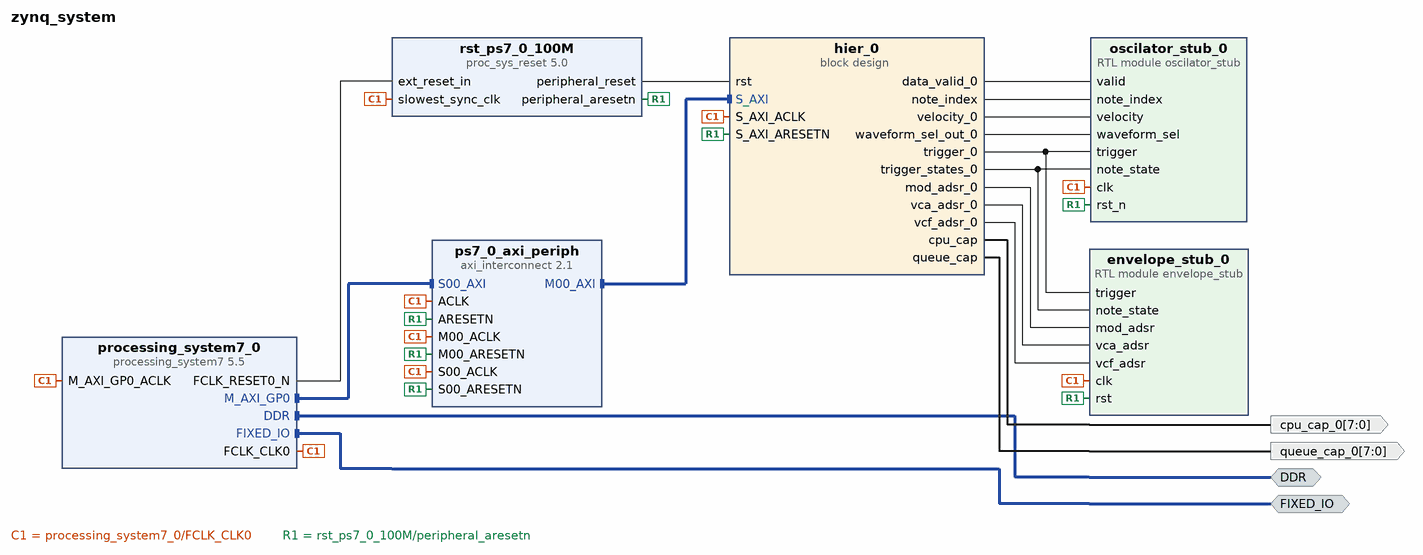
[diagram p0: block diagram of the top level]
# Vivado block design zynq_system, xc7z020clg400-1, Vivado 2021.1
create_bd_design zynq_system

create_bd_intf_port -mode Master -vlnv xilinx.com:interface:ddrx_rtl:1.0 DDR
create_bd_intf_port -mode Master -vlnv xilinx.com:display_processing_system7:fixedio_rtl:1.0 FIXED_IO
create_bd_port -dir O -from 7 -to 0 cpu_cap_0
create_bd_port -dir O -from 7 -to 0 queue_cap_0

create_bd_cell -type ip -vlnv xilinx.com:ip:processing_system7:5.5 processing_system7_0
set_property -dict [list \
  CONFIG.PCW_FPGA0_PERIPHERAL_FREQMHZ 100 \
  CONFIG.PCW_M_AXI_GP0_ENABLE_STATIC_REMAP 1 \
  CONFIG.PCW_M_AXI_GP0_THREAD_ID_WIDTH 6 \
  CONFIG.PCW_UART1_PERIPHERAL_ENABLE 1 \
  CONFIG.PCW_UART1_UART1_IO {MIO 8 .. 9} \
  CONFIG.PCW_UART_PERIPHERAL_FREQMHZ 100 \
  CONFIG.PCW_UIPARAM_GENERATE_SUMMARY NONE \
] [get_bd_cells processing_system7_0]
# 55 more settings of processing_system7_0 are not shown: defaults, MIO pin electricals, DDR timing, and values the tool derives
create_bd_cell -type ip -vlnv xilinx.com:ip:axi_interconnect:2.1 ps7_0_axi_periph
set_property -dict [list \
  CONFIG.ENABLE_ADVANCED_OPTIONS 0 \
  CONFIG.M00_SECURE 1 \
  CONFIG.NUM_MI 1 \
  CONFIG.S00_HAS_DATA_FIFO 0 \
  CONFIG.S00_HAS_REGSLICE 3 \
] [get_bd_cells ps7_0_axi_periph]
create_bd_cell -type ip -vlnv xilinx.com:ip:proc_sys_reset:5.0 rst_ps7_0_100M
create_bd_cell -type container -reference group_0 hier_0
set_property -dict [list \
  CONFIG.ACTIVE_SIM_BD group_0.bd \
  CONFIG.ACTIVE_SYNTH_BD group_0.bd \
  CONFIG.ENABLE_DFX 0 \
  CONFIG.LIST_SIM_BD group_0.bd \
  CONFIG.LIST_SYNTH_BD group_0.bd \
  CONFIG.LOCK_PROPAGATE 0 \
] [get_bd_cells hier_0]
create_bd_cell -type module -reference oscilator_stub oscilator_stub_0
create_bd_cell -type module -reference envelope_stub envelope_stub_0

# ---- connections ----

connect_bd_intf_net [get_bd_intf_ports DDR] [get_bd_intf_pins processing_system7_0/DDR]
connect_bd_intf_net [get_bd_intf_ports FIXED_IO] [get_bd_intf_pins processing_system7_0/FIXED_IO]
connect_bd_intf_net [get_bd_intf_pins processing_system7_0/M_AXI_GP0] [get_bd_intf_pins ps7_0_axi_periph/S00_AXI]
connect_bd_intf_net [get_bd_intf_pins ps7_0_axi_periph/M00_AXI] [get_bd_intf_pins hier_0/S_AXI]
connect_bd_net -net fifo_reader_0_trigger [get_bd_pins hier_0/trigger_0] [get_bd_pins oscilator_stub_0/trigger] [get_bd_pins envelope_stub_0/trigger]
connect_bd_net [get_bd_pins hier_0/cpu_cap] [get_bd_ports cpu_cap_0]
connect_bd_net [get_bd_pins hier_0/data_valid_0] [get_bd_pins oscilator_stub_0/valid]
connect_bd_net [get_bd_pins hier_0/mod_adsr_0] [get_bd_pins envelope_stub_0/mod_adsr]
connect_bd_net [get_bd_pins hier_0/note_index] [get_bd_pins oscilator_stub_0/note_index]
connect_bd_net [get_bd_pins hier_0/queue_cap] [get_bd_ports queue_cap_0]
connect_bd_net [get_bd_pins hier_0/trigger_states_0] [get_bd_pins oscilator_stub_0/note_state] [get_bd_pins envelope_stub_0/note_state]
connect_bd_net [get_bd_pins hier_0/vca_adsr_0] [get_bd_pins envelope_stub_0/vca_adsr]
connect_bd_net [get_bd_pins hier_0/vcf_adsr_0] [get_bd_pins envelope_stub_0/vcf_adsr]
connect_bd_net [get_bd_pins hier_0/velocity_0] [get_bd_pins oscilator_stub_0/velocity]
connect_bd_net -net hier_0_waveform_sel_0 [get_bd_pins hier_0/waveform_sel_out_0] [get_bd_pins oscilator_stub_0/waveform_sel]
connect_bd_net [get_bd_pins processing_system7_0/FCLK_CLK0] \
  [get_bd_pins ps7_0_axi_periph/M00_ACLK] [get_bd_pins rst_ps7_0_100M/slowest_sync_clk] \
  [get_bd_pins ps7_0_axi_periph/S00_ACLK] [get_bd_pins ps7_0_axi_periph/ACLK] \
  [get_bd_pins processing_system7_0/M_AXI_GP0_ACLK] [get_bd_pins hier_0/S_AXI_ACLK] [get_bd_pins oscilator_stub_0/clk] \
  [get_bd_pins envelope_stub_0/clk]
connect_bd_net [get_bd_pins processing_system7_0/FCLK_RESET0_N] [get_bd_pins rst_ps7_0_100M/ext_reset_in]
connect_bd_net [get_bd_pins rst_ps7_0_100M/peripheral_aresetn] \
  [get_bd_pins ps7_0_axi_periph/M00_ARESETN] [get_bd_pins ps7_0_axi_periph/S00_ARESETN] \
  [get_bd_pins ps7_0_axi_periph/ARESETN] [get_bd_pins hier_0/S_AXI_ARESETN] [get_bd_pins oscilator_stub_0/rst_n] \
  [get_bd_pins envelope_stub_0/rst]
connect_bd_net [get_bd_pins rst_ps7_0_100M/peripheral_reset] [get_bd_pins hier_0/rst]
set_property PFM.AXI_PORT {M_AXI_GP1 {memport "M_AXI_GP" sptag "" memory "" is_range "false"}} [get_bd_cells processing_system7_0]
set_property PFM.CLOCK {FCLK_CLK0 {id "1" is_default "true" proc_sys_reset "/rst_ps7_0_100M" status "fixed" freq_hz "100000000"}} [get_bd_cells processing_system7_0]

# ---- address map ----
assign_bd_address -offset 0x43C00000 -range 64K -target_address_space [get_bd_addr_spaces processing_system7_0/Data] [get_bd_addr_segs hier_0/axi_regmap_0/S_AXI/reg0]

validate_bd_design
save_bd_design
